# Altium project dctr.PrjPCB
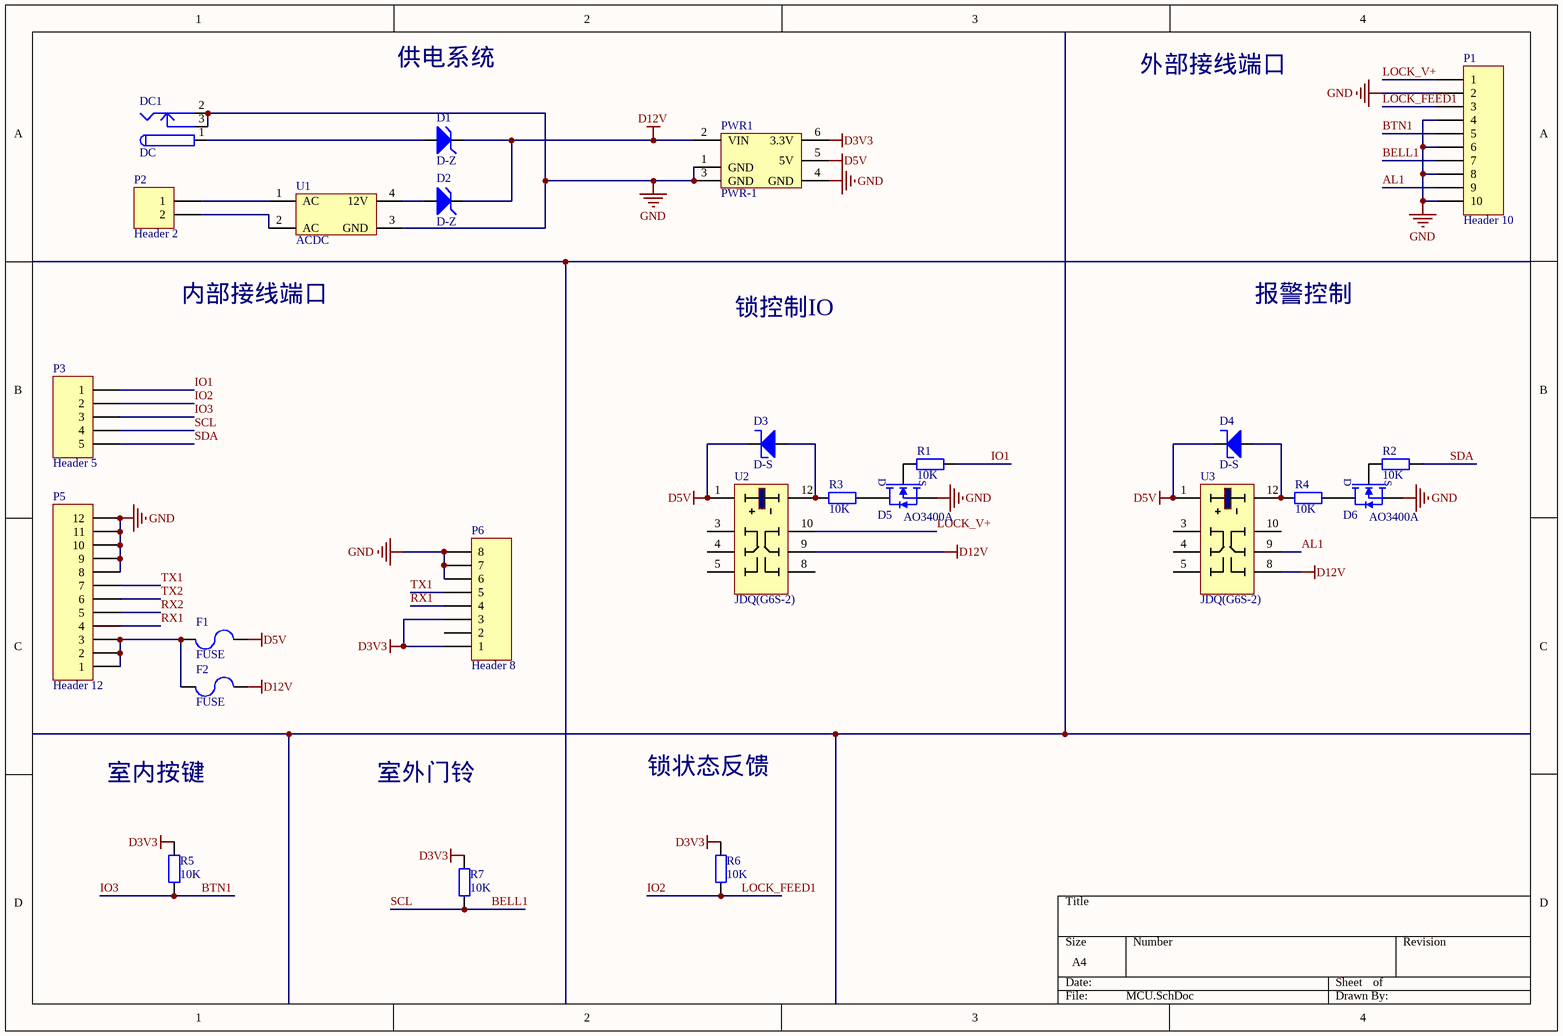
[diagram p0: MCU.SchDoc]
1 sheet, 25 parts. Net scope: global (net labels, ports and power ports of the same name join across sheets).
Board file: dctr_v1.2.pcbDoc

## Sheet MCU.SchDoc
size A4

### Parts
D1  D-Z  [DO-214AC(SMA)]
D2  D-Z  [DO-214AC(SMA)]
D3  D-S  [DO-214AC(SMA)]
D4  D-S  [DO-214AC(SMA)]
D5  AO3400A  [SOT23A]
D6  AO3400A  [SOT23A]
DC1  DC  [DC005]
F1  FUSE  [0805F]
F2  FUSE  [0805F]
P1  Header 10  [KF128-5.08-10]
P2  Header 2  [KF128-5.08-2]
P3  Header 5  [XH2.54-5]
P5  Header 12  [FFC/SM1.0-2H10]
P6  Header 8  [FPC/1.25T-6P]
PWR1  PWR-1  [PWR-1]
R1  10K  [0603R]
R2  10K  [0603R]
R3  10K  [0603R]
R4  10K  [0603R]
R5  10K  [0603R]
R6  10K  [0603R]
R7  10K  [0603R]
U1  ACDC  [ACDC]
U2  JDQ(G6S-2)  [JDQ-G6S-2]
U3  JDQ(G6S-2)  [JDQ-G6S-2]

### Nets
D3V3: P6.1 P6.3 PWR1.6(3.3V) R5.2 R6.2 R7.2
D5V: D3.K D4.K F1.1 PWR1.5(5V) U2.1 U3.1
D12V: D1.K D2.K F2.1 PWR1.2(VIN) U2.9 U3.8
GND: D5.2(S) D6.2(S) DC1.2 DC1.3 P1.2 P1.4 P1.6 P1.8 P1.10 P5.8 P5.9 P5.10 P5.11 P5.12 P6.6 P6.7 P6.8 PWR1.1(GND) PWR1.3(GND) PWR1.4(GND) U1.3(GND)
AL1: P1.9 U3.9
BELL1: P1.7 P3.4 R7.1  [also labelled SCL]
BTN1: P1.5 P3.3 R5.1  [also labelled IO3]
IO1: P3.1 R1.2
IO2: P1.3 P3.2 R6.1  [also labelled LOCK_FEED1]
LOCK_V+: P1.1 U2.10
RX1: P5.4 P6.4
RX2: P5.5
SDA: P3.5 R2.2
TX1: P5.7 P6.5
TX2: P5.6
NetD1_A: D1.A DC1.1
NetD2_A: D2.A U1.4(12V)
NetD3_A: D3.A R3.1 U2.12
NetD4_A: D4.A R4.1 U3.12
NetD5_1: D5.1(G) R1.1
NetD5_3: D5.3(D) R3.2
NetD6_1: D6.1(G) R2.1
NetD6_3: D6.3(D) R4.2
NetF1_2: F1.2 F2.2 P5.1 P5.2 P5.3
NetP2_1: P2.1 U1.1(AC)
NetP2_2: P2.2 U1.2(AC)

Not connected (* = marked no-connect by the designer): P6 2; U2 3 4 5 8; U3 3 4 5 10

### Notes on the sheet
- 供电系统
- 外部接线端口
- 内部接线端口
- 报警控制
- 锁控制IO
- 室内按键
- 室外门铃
- 锁状态反馈

### Library data of the parts
D1 D2 = D-Z: 稳压二极管
D3 D4 = D-S: 肖特基二极管
D5 D6 = MOS-N: NMOS
DC1 = DC00X: 圆形电源接口
F1 F2 = FUSE: CR-1812-050A60V
P1 = Header 10: Header, 10-Pin; LatestRevisionDate: 17-Jul-2002; LatestRevisionNote: Re-released for DXP Platform.; Publisher: Altium Limited
P2 = Header 2: Header, 2-Pin; LatestRevisionDate: 17-Jul-2002; LatestRevisionNote: Re-released for DXP Platform.; Publisher: Altium Limited
P3 = Header 5: Header, 5-Pin; LatestRevisionDate: 17-Jul-2002; LatestRevisionNote: Re-released for DXP Platform.; Publisher: Altium Limited
P5 = Header 12: Header, 12-Pin; LatestRevisionDate: 17-Jul-2002; LatestRevisionNote: Re-released for DXP Platform.; Publisher: Altium Limited
P6 = Header 8: Header, 8-Pin; LatestRevisionDate: 17-Jul-2002; LatestRevisionNote: Re-released for DXP Platform.; Publisher: Altium Limited
R1-R7 = RES: 普通电阻
U1 = ACDC12
U2 U3 = JDQ(G6S-2): 继电器（G6S-2 5VDC）